# Altium schematic sheet Optical_RX_TX_15-18.SchDoc
size A4; CompanyName: Technische Hochschule Nürnberg Georg Simon Ohm; Organization: UltraZohm; Address1: Kesslerplatz 12; Address2: 90489 Nürnberg; Address3: GERMANY; DocumentNumber: 5; SheetNumber: 5; SheetTotal: 5; Website: www.ultrazohm.com
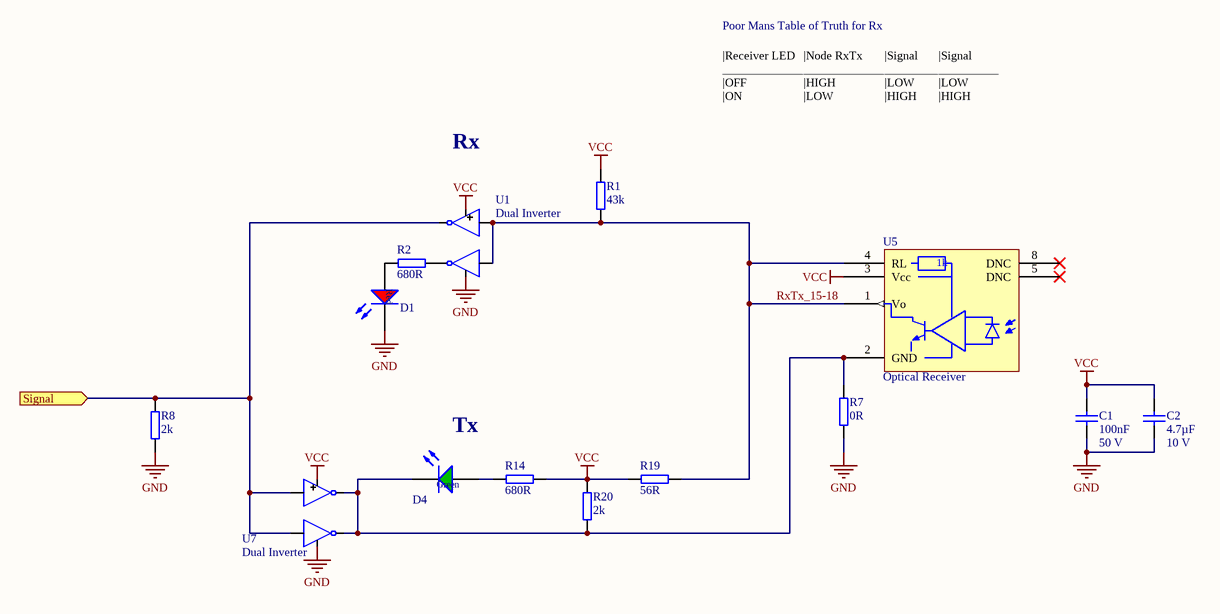
[diagram p0: Optical_RX_TX_15-18.SchDoc]

## Parts
C1  Rated Voltage: 50 V  [C_0603(1608)100_L]  (hidden comment: 100nF)
C2  Voltage: 10 V  [CAP_2012X06N]  (hidden comment: 4.7µF)
D1  150060RS75000  [WL-SMCW_0603]  (value not drawn)
D4  150060GS75000  [WL-SMCW_0603]  (value not drawn)
R1  43k  [R_0603_N]
R2  680R  [R_0603_N]
R7  0R  [R_0603_N]
R8  2k  [R_0603_N]
R14  680R  [R_0603_N]
R19  56R  [RES_2012X06N]
R20  2k  [R_0603_N]
U1  Dual Inverter  [SN74LVC2GU04DCKR]
U5  Optical Receiver  [HFBRx5XX]
U7  Dual Inverter  [SN74LVC2GU04DCKR]

## Ports
Signal (in)

## Nets
GND: C1.2 C2.2 D1.1(K) R7.2 R8.1 U1.2(GND) U7.2(GND)
VCC: C1.1 C2.1 R1.1 R14.1 R19.1 R20.2 U1.5(VCC) U5.3(Vcc) U7.5(VCC)
RxTx_15-18: R1.2 R19.2 U1.1(IN1) U1.3(IN2) U5.1(Vo) U5.4(RL)
Signal: R8.2 U1.6(OUT2) U7.1(IN1) U7.3(IN2) ; port Signal
NetD1_2: D1.2(A) R2.2
NetD4_1: D4.1(K) R7.1 R20.1 U5.2(GND) U7.4(OUT2) U7.6(OUT2)
NetD4_2: D4.2(A) R14.2
NetR2_1: R2.1 U1.4(OUT2)

Not connected (* = marked no-connect by the designer): U5 5(DNC)* 8(DNC)*

## Notes on the sheet
- Poor Mans Table of Truth for Rx
- Rx
- |Receiver LED
  ________________
  |OFF
  |ON
- |Node RxTx
  _________________
  |HIGH
  |LOW
- |Signal
  _______________
  |LOW
  |HIGH
- GATE
  _______
  LOW
  HIGH
- |Signal
  __________
  |LOW
  |HIGH
- Tx
- Title
- Size:
- Date:
- A4
- Revision:
- Time:
- Sheet
- of
- Author:
- Project:
- (in symbol HFBR-2528Z) 1k

## Library data of the parts
C1 = C_0603: CAP 0603 (1608 Metric) SMD; Tolerance: ±5%; Case-Metric: 1608; Case-EIA: 0603; Max Thickness: 1 mm; Technology: SMT; Created: 2018_09_06_AGeiger; Dielectric: *; Supplier 1: *; Supplier Part Number 1: *; MF: *; MPN: *; Value: 100nF; Package: 0603; LCSC Part #: C14663
C2 = C_0805: CAP 0805 (2012 Metric) SMD; MPN: LMF212B7475KGHT; Tolerance: ±10%; Case-Metric: 2012; Dielectric: X7R; MF: Taiyo Yuden; Case-EIA: 0805; Max Thickness: 1 mm; Technology: SMT; Created: 2018_09_06_AGeiger; Supplier 1: Mouser; Supplier Part Number 1: 963-LMF212B7475KGHT; Value: 4.7µF; Package: 0805; LCSC Part #: C1779
D1 = LED_Red_0603: WL-SMCW SMD Mono-color Chip LED Waterclear, size 0603, Red, 2 V, 140°; Forward Voltage: 2 V; Luminous Intensity: 250 mcd; Peak Wavelength: 630 nm; Dominant Wavelength: 625 nm; MF: Wuerth Elektronik; Published Date: Sep. 2017; ComponentLink1Description: Manufacturer; ComponentLink1URL: http://www.we-online.de; ComponentLink2Description: Datasheet; ComponentLink2URL: http://katalog.we-online.com/led/datasheet/150060RS75000.pdf; MPN: 150060RS75000; Size: 0603; Viewing Angle: 140°; Emitting Color: Red; Value: 150060RS75000; Package: 0603; Created: 2018_09_06_AGeiger; Supplier 1: Farnell; Supplier Part Number 1: 2322071; Supplier 2: Mouser; Supplier Part Number 2: 710-150060RS75000; Supplier 3: Digi-Key; Supplier Part Number 3: 732-4978-1-ND; LCSC Part #: C2286
D4 = LED_Green_0603: WL-SMCW SMD Mono-color Chip LED Waterclear, size 0603, Green, 3.2 V, 140°; Forward Voltage: 3.2 V; Luminous Intensity: 430 mcd; Peak Wavelength: 515 nm; Dominant Wavelength: 520 nm; MF: Wuerth Elektronik; Published Date: Sep. 2017; ComponentLink1Description: Manufacturer; ComponentLink1URL: http://www.we-online.de; ComponentLink2Description: Datasheet; ComponentLink2URL: http://katalog.we-online.com/led/datasheet/150060GS75000.pdf; MPN: 150060GS75000; Size: 0603; Viewing Angle: 140°; Emitting Color: Green; Value: 150060GS75000; Package: 0603; Created: 2018_09_06_AGeiger; Supplier 1: Farnell; Supplier Part Number 1: 2322070; Supplier 2: Mouser; Supplier Part Number 2: 710-150060GS75000; Supplier 3: Digi-Key; Supplier Part Number 3: 732-4971-1-ND; LCSC Part #: C72043
R1 = R_0603_JLC: SMD Resistor 0603; Tolerance: 1%; Voltage: 50V; Power: 100 mW; Package: 0603; Value: 43k; Created: 2018_09_06_AGeiger; Supplier 1: *; Supplier Part Number 1: *; LCSC Part #: C23172
R2 R14 = R_0603: SMD Resistor 0603; MPN: CR0603-FX-3901ELF; Tolerance: 1%; Voltage: 75V; Power: 100 mW; MF: Bourns; Package: 0603; Value: 680R; Created: 2018_09_06_AGeiger; Supplier 1: Mouser; Supplier Part Number 1: 652-CR0603-FX3901ELF; LCSC Part #: C23228
R7 = R_0603: SMD Resistor 0603; MPN: CRCW06030000Z0EBC; Tolerance: 1%; Voltage: 75V; Power: 100 mW; MF: Vishay; Package: 0603; Value: 0R; Created: 2018_09_06_AGeiger; Supplier 1: Mouser; Supplier Part Number 1: 71-CRCW06030000Z0EBC; LCSC Part #: C21189
R8 R20 = R_0603: SMD Resistor 0603; MPN: RC0603FR-072KL; Tolerance: 1%; Voltage: 75 V; Power: 100 mW; MF: Yageo; Package: 0603; Value: 2k; Created: 2018_09_06_AGeiger; Supplier 1: Mouser; Supplier Part Number 1: 603-RC0603FR-072KL; LCSC Part #: C22975
R19 = R_0805: SMD Resistor 0805; MPN: CR0805-FX-1200ELF; Case_EIA: 0805; MF: Bourns; Voltage: 150 V; Power: 125 mW; Tolerance: 1%; Value: 56R; Supplier 1: Mouser; Supplier Part Number 1: 652-CR0805FX-1200ELF*; LCSC Part #: C17437
U1 U7 = SN74LVC2GU04DCKR: This dual inverter is designed for 1.65-V to 5.5-V VCC / operation.; LCSC Part #: C116660; JLCSMT Rotation: 180
U5 = HFBR-2528Z: Fibre Optic Receivers, LINK HORIZ 5MBd RC VR RoHS; MPN: HFBR-2521Z; Suppier Part Number 2: 516-2062-ND; MF: Boadcom/Avago; Wavelength: 660 nm; Iout max: 25 mA; Supply Voltage: 5V; Created: 2019_04_09_Kreppel; Data Rate: 5 MBd; Supplier 1: Mouser; Supplier 2: Digi-Key; Supplier Part Number 1: 630-HFBR-2521Z